# Altium schematic sheet Power Controller In ROV V1.0.SchDoc
size A4
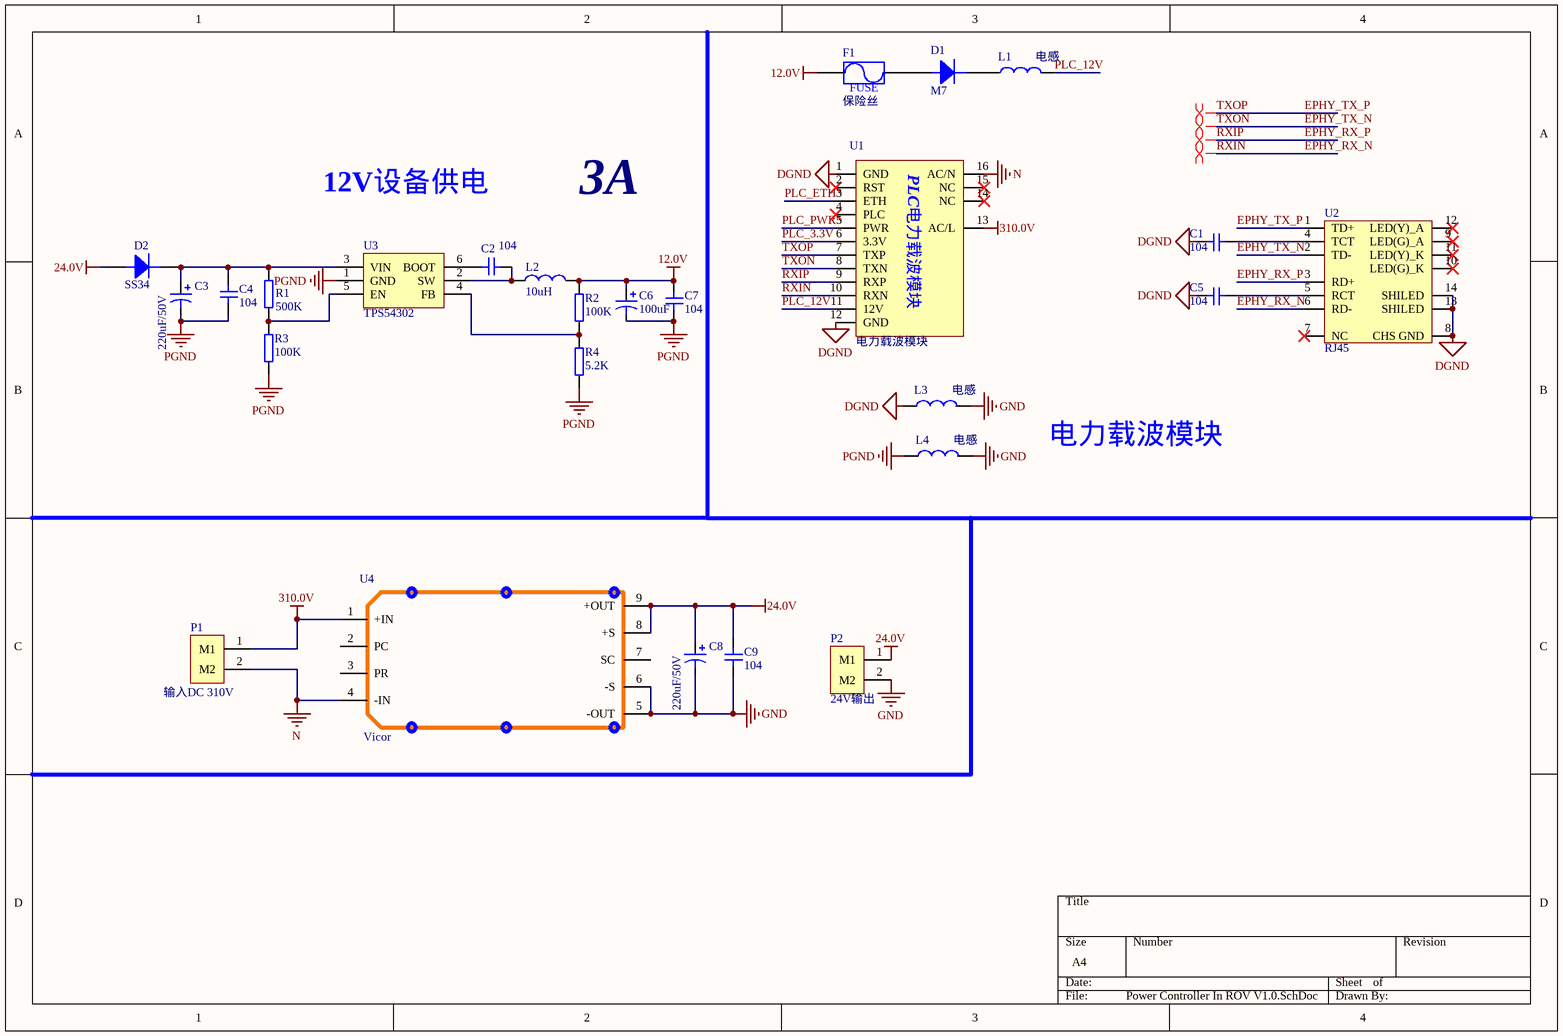
[diagram p0: Power Controller In ROV V1.0.SchDoc]

## Parts
C1  104  [0805C]
C2  104  [0805C]
C3  220uF/50V  [RB.1.2]
C4  104  [0805C]
C5  104  [0805C]
C6  100uF  [TAJ-C]
C7  104  [0805C]
C8  220uF/50V  [RB.2.4]
C9  104  [0805C]
D1  M7  [SMA/DO-214AC]
D2  SS34  [SMA/DO-214AC]
F1  保险丝  [FUSE-1206]
L1  电感  [1206L]
L2  10uH  [电感]
L3  电感  [1206L]
L4  电感  [1206L]
P1  输入DC 310V  [XT60-F]
P2  24V输出  [XT60-F]
R1  500K  [0805R]
R2  100K  [0805R]
R3  100K  [0805R]
R4  5.2K  [0805R]
U1  电力载波模块  [电力载波模块6410]
U2  RJ45  [RJ45]
U3  TPS54302  [SOT23-6]
U4  Vicor  [vicor]

## Nets
12.0V: C6.1 C7.2 F1.1 L2.2 R2.2
24.0V: C8.1 C9.2 D2.1 P2.1(M1) U4.8(+S) U4.9(+OUT)
310.0V: P1.1(M1) U1.13(AC/L) U4.1(+IN)
DGND: C1.1 C5.1 L3.1 U1.1(GND) U1.12(GND) U2.8(CHS_GND) U2.13(SHILED) U2.14(SHILED)
GND: C8.2 C9.1 L3.2 L4.2 P2.2(M2) U4.5(-OUT) U4.6(-S)
N: P1.2(M2) U1.16(AC/N) U4.4(-IN)
PGND: C3.2 C4.1 C6.2 C7.1 L4.1 R3.1 R4.1 U3.1(GND)
EPHY_RX_N: U1.10(RXN) U2.6(RD-)  [also labelled RXIN]
EPHY_RX_P: U1.9(RXP) U2.3(RD+)  [also labelled RXIP]
EPHY_TX_N: U1.8(TXN) U2.2(TD-)  [also labelled TXON]
EPHY_TX_P: U1.7(TXP) U2.1(TD+)  [also labelled TXOP]
PLC_3.3V: U1.6(3.3V)
PLC_12V: L1.2 U1.11(12V)
PLC_ETH: U1.3(ETH)
PLC_PWR: U1.5(PWR)
NetC1_2: C1.2 U2.4(TCT)
NetC2_1: C2.1 L2.1 U3.2(SW)
NetC2_2: C2.2 U3.6(BOOT)
NetC3_1: C3.1 C4.2 D2.2 R1.2 U3.3(VIN)
NetC5_2: C5.2 U2.5(RCT)
NetD1_1: D1.1 F1.2
NetD1_2: D1.2 L1.1
NetR1_1: R1.1 R3.2 U3.5(EN)
NetR2_1: R2.1 R4.2 U3.4(FB)

Not connected (* = marked no-connect by the designer): U1 2(RST)* 4(PLC)* 14(NC)* 15(NC)*; U2 7(NC)* 9(LED(G)_A)* 10(LED(G)_K)* 11(LED(Y)_K)* 12(LED(Y)_A)*; U4 2(PC) 3(PR) 7(SC)

## Layout directives
differential pair: EPHY_RX_N, EPHY_RX_P, EPHY_TX_N, EPHY_TX_P

## Notes on the sheet
- 12V设备供电
- 3A
- 电力载波模块
- (in symbol Fuse) FUSE
- (in symbol 电力载波模块6410) PLC电力载波模块

## Library data of the parts
C1 C2 C4 C5 C7 C9 = Cap1: 无极贴片电容
C3 C8 = Cap3: 直插极性电容
C6 = Pol Cap: 极性贴片电容
D1 D2 = Diode: 二极管
F1 = Fuse
L1 L3 L4 = L
L2 = L: 电感
P1 P2 = 接线端子-2PIN: 2PIN
R1-R4 = Res: 电阻
U1 = 电力载波模块6410
U4 = 滨达模块（220V--24V）